# EAGLE schematic oven_redux_blank (EAGLE 9.5.1)
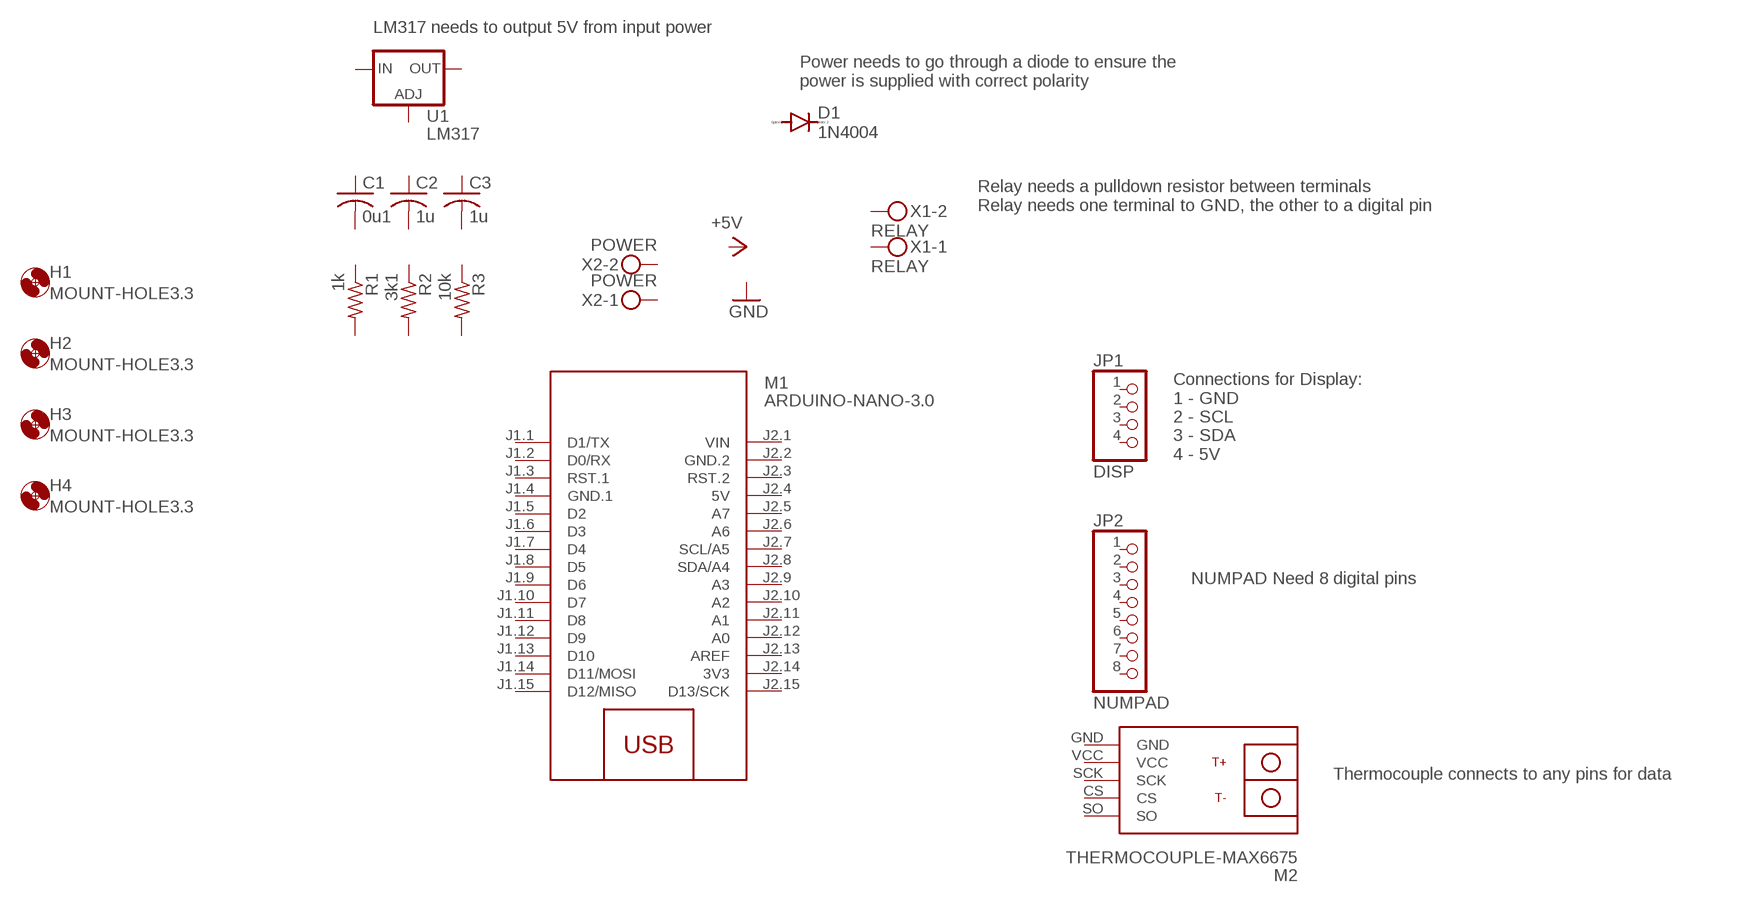
[diagram p0: schematic, sheet 1]

## Parts
C1  0u1  C-US025-050X050  [C025-050X050]
C2  1u  C-US025-050X050  [C025-050X050]
C3  1u  C-US025-050X050  [C025-050X050]
D1  1N4004  [DO41-10]
H1  MOUNT-HOLE3.3  [3,3]
H2  MOUNT-HOLE3.3  [3,3]
H3  MOUNT-HOLE3.3  [3,3]
H4  MOUNT-HOLE3.3  [3,3]
JP1  DISP  PINHD-1X4  [1X04]
JP2  NUMPAD  PINHD-1X8  [1X08]
M1  ARDUINO-NANO-3.0  [ARDUINO-NANO-3.0]
M2  THERMOCOUPLE-MAX6675  [THERMOCOUPLE-MAX6675]
R1  1k  R-US_0204/7  [0204/7]
R2  3k1  R-US_0204/7  [0204/7]
R3  10k  R-US_0204/7  [0204/7]
U1  LM317  LM317TL  [317TL]
X1  RELAY  MKDSN1,5/2-5,08  [MKDSN1,5/2-5,08]
X2  POWER  MKDSN1,5/2-5,08  [MKDSN1,5/2-5,08]
Unconnected: C1.1 C1.2 C2.1 C2.2 C3.1 C3.2 D1.A D1.C JP1.1 JP1.2 JP1.3 JP1.4 JP2.1 JP2.2 JP2.3 JP2.4 JP2.5 JP2.6 JP2.7 JP2.8 M1.J1.1(D1/TX) M1.J1.2(D0/RX) M1.J1.3(RST.1) M1.J1.5(D2) M1.J1.6(D3) M1.J1.7(D4) M1.J1.8(D5) M1.J1.9(D6) M1.J1.10(D7) M1.J1.11(D8) M1.J1.12(D9) M1.J1.13(D10) M1.J1.14(D11/MOSI) M1.J1.15(D12/MISO) M1.J2.3(RST.2) M1.J2.5(A7) M1.J2.6(A6) M1.J2.7(SCL/A5) M1.J2.8(SDA/A4) M1.J2.9(A3) M1.J2.10(A2) M1.J2.11(A1) M1.J2.12(A0) M1.J2.13(AREF) M1.J2.15(D13/SCK) M2.CS M2.GND M2.SCK M2.SO R1.1 R1.2 R2.1 R2.2 R3.1 R3.2 U1.1(ADJ) U1.2(OUT) U1.3(IN) X1.1 X1.2 X2.1 X2.2

## Notes on the sheet
- LM317 needs to output 5V from input power
- Power needs to go through a diode to ensure the
  power is supplied with correct polarity
- Relay needs a pulldown resistor between terminals
  Relay needs one terminal to GND, the other to a digital pin
- Connections for Display:
  1 - GND
  2 - SCL
  3 - SDA
  4 - 5V
- NUMPAD Need 8 digital pins
- Thermocouple connects to any pins for data

## Power pins joined to a net without a drawn wire
3V3: M1.J2.14(3V3)
5V: M1.J2.4(5V)
GND.1: M1.J1.4(GND.1)
GND.2: M1.J2.2(GND.2)
VCC: M2.VCC
VIN: M1.J2.1(VIN)

## Library data of the parts
C1-C3 = rcl:C-US: CAPACITOR, American symbol; SPICEPREFIX: C
D1 = diode:1N4004: DIODE general purpose rectifier, 1 A
H1-H4 = holes:MOUNT-HOLE: MOUNTING HOLE with drill center marker
JP1 = pinhead:PINHD-1X4: PIN HEADER
JP2 = pinhead:PINHD-1X8: PIN HEADER
M1 = diy-modules:ARDUINO-NANO-3.0: Arduino Nano 3.0 and compatible devices More details available here: https://www.arduino.cc/en/Main/ArduinoBoardNano Click here to find device on ebay.com <http://www.ebay.com/sch/arduino+nano>
M2 = diy-modules:THERMOCOUPLE-MAX6675: Thermocouple Analog-to-Digital Converter based on MAX6675 chip
R1-R3 = rcl:R-US_: RESISTOR, American symbol; SPICEPREFIX: R
U1 = v-reg:LM317TL: VOLTAGE REGULATOR
X1 X2 = con-phoenix-508:MKDSN1,5/2-5,08: MKDSN 1,5/ 2-5,08 Printklemme Nennstrom: 13,5 A Nennspannung: 250 V Rastermaß: 5,08 mm Polzahl: 2 Anschlussart: Schraubanschluss Montage: Löten Anschlussrichtung Leiter/Platine: 0 ° Artikelnummer: 1729128 Source: http://eshop.phoenixcontact.com .. 1729128.pdf